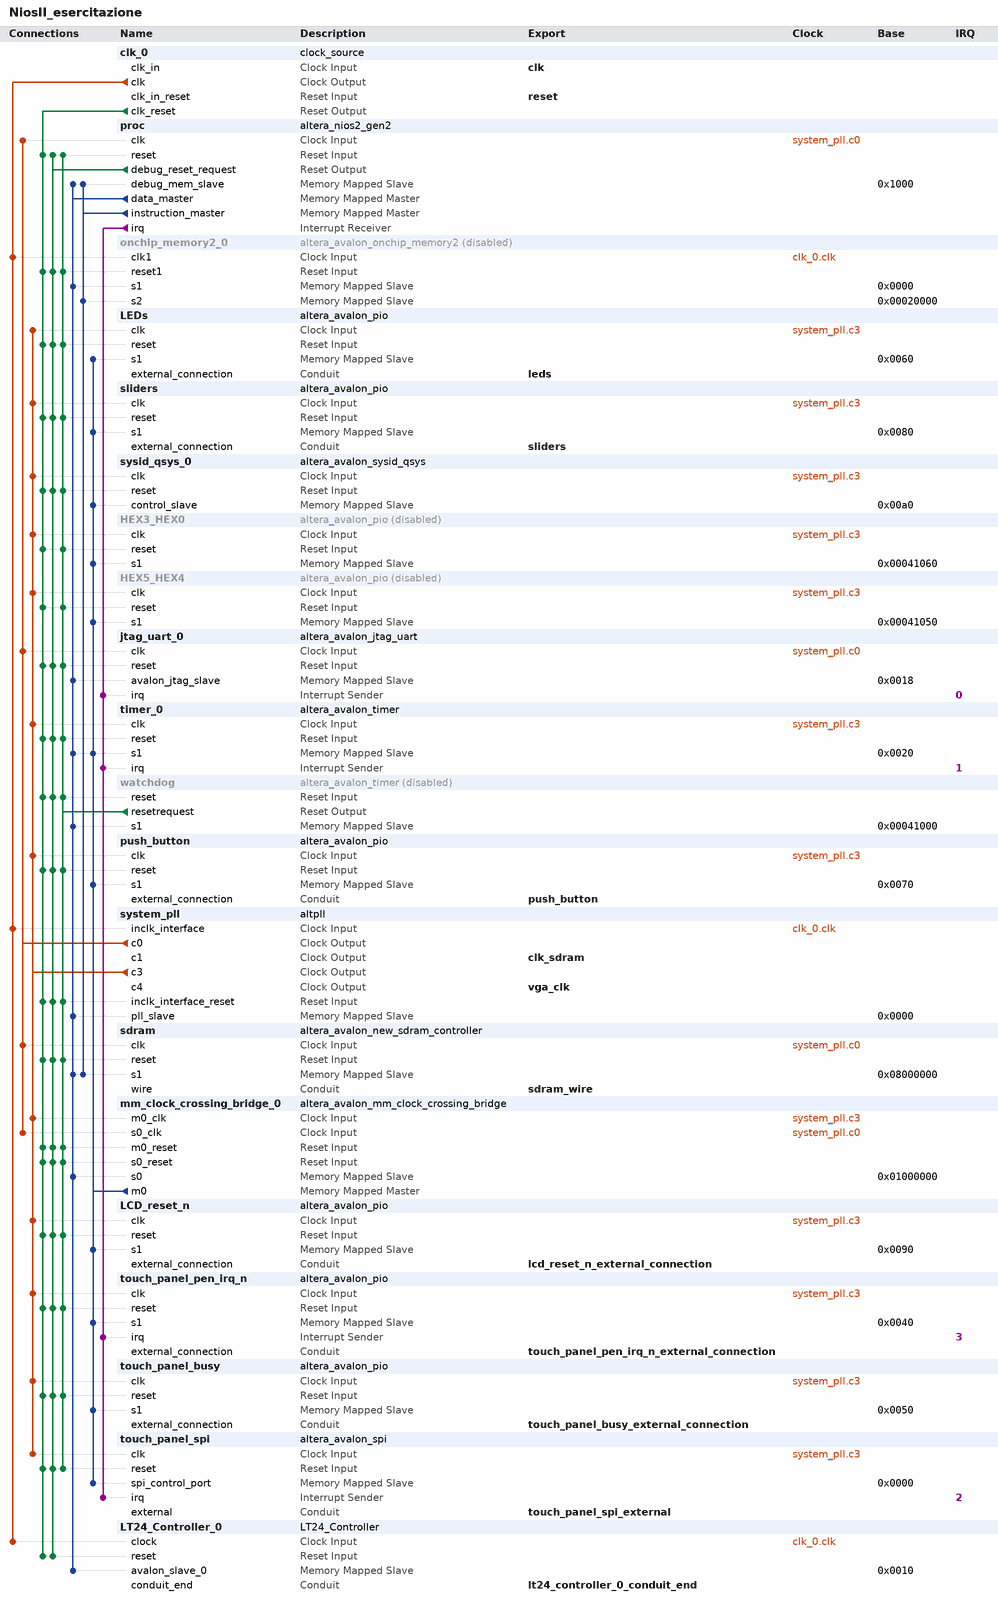
[diagram p0: system contents]
# Platform Designer (Qsys) system NiosII_esercitazione, MAX 10 10M50DAF484C7G
# Parameters at their usual value, and those the tool derives, are not listed.
package require -exact qsys 16.1
create_system NiosII_esercitazione
set_project_property DEVICE_FAMILY {MAX 10}
set_project_property DEVICE 10M50DAF484C7G

add_instance clk_0 clock_source 16.1
set_instance_parameter_value clk_0 clockFrequency 50000000
set_instance_parameter_value clk_0 resetSynchronousEdges DEASSERT

add_instance proc altera_nios2_gen2 16.1
set_instance_parameter_value proc dcache_size 2048
set_instance_parameter_value proc exceptionOffset 4194304
set_instance_parameter_value proc exceptionSlave sdram.s1
set_instance_parameter_value proc icache_size 4096
set_instance_parameter_value proc impl Fast
set_instance_parameter_value proc resetSlave sdram.s1

add_instance onchip_memory2_0 altera_avalon_onchip_memory2 16.1
set_instance_property onchip_memory2_0 ENABLED false
set_instance_parameter_value onchip_memory2_0 dataWidth 32
set_instance_parameter_value onchip_memory2_0 dualPort true
set_instance_parameter_value onchip_memory2_0 initMemContent true
set_instance_parameter_value onchip_memory2_0 initializationFileName onchip_mem.hex
set_instance_parameter_value onchip_memory2_0 memorySize 131072
set_instance_parameter_value onchip_memory2_0 singleClockOperation true

add_instance LEDs altera_avalon_pio 16.1
set_instance_parameter_value LEDs direction Output
set_instance_parameter_value LEDs width 10

add_instance sliders altera_avalon_pio 16.1
set_instance_parameter_value sliders direction Input
set_instance_parameter_value sliders width 10

add_instance sysid_qsys_0 altera_avalon_sysid_qsys 16.1
set_instance_parameter_value sysid_qsys_0 id 1

add_instance HEX3_HEX0 altera_avalon_pio 16.1
set_instance_property HEX3_HEX0 ENABLED false
set_instance_parameter_value HEX3_HEX0 direction Output
set_instance_parameter_value HEX3_HEX0 width 8

add_instance HEX5_HEX4 altera_avalon_pio 16.1
set_instance_property HEX5_HEX4 ENABLED false
set_instance_parameter_value HEX5_HEX4 direction Output
set_instance_parameter_value HEX5_HEX4 width 32

add_instance jtag_uart_0 altera_avalon_jtag_uart 16.1
set_instance_parameter_value jtag_uart_0 simInteractiveOptions NO_INTERACTIVE_WINDOWS

add_instance timer_0 altera_avalon_timer 16.1
set_instance_parameter_value timer_0 period 1
set_instance_parameter_value timer_0 periodUnits MSEC

add_instance watchdog altera_avalon_timer 16.1
set_instance_property watchdog ENABLED false
set_instance_parameter_value watchdog alwaysRun true
set_instance_parameter_value watchdog fixedPeriod true
set_instance_parameter_value watchdog period 5
set_instance_parameter_value watchdog periodUnits SEC
set_instance_parameter_value watchdog resetOutput true
set_instance_parameter_value watchdog snapshot false

add_instance push_button altera_avalon_pio 16.1
set_instance_parameter_value push_button direction Input
set_instance_parameter_value push_button width 2

add_instance system_pll altpll 16.1
set_instance_parameter_value system_pll CLK0_DIVIDE_BY 1
set_instance_parameter_value system_pll CLK0_MULTIPLY_BY 2
set_instance_parameter_value system_pll CLK1_DIVIDE_BY 1
set_instance_parameter_value system_pll CLK1_DUTY_CYCLE 50
set_instance_parameter_value system_pll CLK1_MULTIPLY_BY 2
set_instance_parameter_value system_pll CLK1_PHASE_SHIFT -3000
set_instance_parameter_value system_pll CLK2_DIVIDE_BY 5
set_instance_parameter_value system_pll CLK2_DUTY_CYCLE 50
set_instance_parameter_value system_pll CLK2_MULTIPLY_BY 1
set_instance_parameter_value system_pll CLK2_PHASE_SHIFT 0
set_instance_parameter_value system_pll CLK3_DIVIDE_BY 5
set_instance_parameter_value system_pll CLK3_DUTY_CYCLE 50
set_instance_parameter_value system_pll CLK3_MULTIPLY_BY 1
set_instance_parameter_value system_pll CLK3_PHASE_SHIFT 0
set_instance_parameter_value system_pll CLK4_DIVIDE_BY 5
set_instance_parameter_value system_pll CLK4_DUTY_CYCLE 50
set_instance_parameter_value system_pll CLK4_MULTIPLY_BY 4
set_instance_parameter_value system_pll CLK4_PHASE_SHIFT 0
set_instance_parameter_value system_pll INCLK0_INPUT_FREQUENCY 20000
set_instance_parameter_value system_pll PORT_ARESET PORT_UNUSED
set_instance_parameter_value system_pll PORT_LOCKED PORT_UNUSED
set_instance_parameter_value system_pll PORT_clk1 PORT_USED
set_instance_parameter_value system_pll PORT_clk2 PORT_USED
set_instance_parameter_value system_pll PORT_clk3 PORT_USED
set_instance_parameter_value system_pll PORT_clk4 PORT_USED

add_instance sdram altera_avalon_new_sdram_controller 16.1
set_instance_parameter_value sdram TAC 5.4
set_instance_parameter_value sdram TRCD 15.0
set_instance_parameter_value sdram TRP 15.0
set_instance_parameter_value sdram casLatency 3
set_instance_parameter_value sdram columnWidth 10
set_instance_parameter_value sdram dataWidth 16
set_instance_parameter_value sdram generateSimulationModel false
set_instance_parameter_value sdram model single_Micron_MT48LC4M32B2_7_chip
set_instance_parameter_value sdram numberOfBanks 4
set_instance_parameter_value sdram numberOfChipSelects 1
set_instance_parameter_value sdram powerUpDelay 100.0
set_instance_parameter_value sdram refreshPeriod 7.8125
set_instance_parameter_value sdram rowWidth 13

add_instance mm_clock_crossing_bridge_0 altera_avalon_mm_clock_crossing_bridge 16.1
set_instance_parameter_value mm_clock_crossing_bridge_0 ADDRESS_WIDTH 10
set_instance_parameter_value mm_clock_crossing_bridge_0 COMMAND_FIFO_DEPTH 8
set_instance_parameter_value mm_clock_crossing_bridge_0 DATA_WIDTH 32
set_instance_parameter_value mm_clock_crossing_bridge_0 MASTER_SYNC_DEPTH 2
set_instance_parameter_value mm_clock_crossing_bridge_0 MAX_BURST_SIZE 1
set_instance_parameter_value mm_clock_crossing_bridge_0 RESPONSE_FIFO_DEPTH 8
set_instance_parameter_value mm_clock_crossing_bridge_0 SLAVE_SYNC_DEPTH 2
set_instance_parameter_value mm_clock_crossing_bridge_0 USE_AUTO_ADDRESS_WIDTH 0

add_instance LCD_reset_n altera_avalon_pio 16.1
set_instance_parameter_value LCD_reset_n direction Output
set_instance_parameter_value LCD_reset_n width 1

add_instance touch_panel_pen_irq_n altera_avalon_pio 16.1
set_instance_parameter_value touch_panel_pen_irq_n captureEdge true
set_instance_parameter_value touch_panel_pen_irq_n direction Input
set_instance_parameter_value touch_panel_pen_irq_n edgeType FALLING
set_instance_parameter_value touch_panel_pen_irq_n generateIRQ true
set_instance_parameter_value touch_panel_pen_irq_n irqType EDGE
set_instance_parameter_value touch_panel_pen_irq_n width 1

add_instance touch_panel_busy altera_avalon_pio 16.1
set_instance_parameter_value touch_panel_busy direction Input
set_instance_parameter_value touch_panel_busy width 1

add_instance touch_panel_spi altera_avalon_spi 16.1
set_instance_parameter_value touch_panel_spi clockPolarity 0
set_instance_parameter_value touch_panel_spi dataWidth 8
set_instance_parameter_value touch_panel_spi masterSPI true
set_instance_parameter_value touch_panel_spi numberOfSlaves 1
set_instance_parameter_value touch_panel_spi targetClockRate 32000

add_instance LT24_Controller_0 LT24_Controller 1.0

# connections
add_connection clk_0.clk LT24_Controller_0.clock clock
add_connection clk_0.clk onchip_memory2_0.clk1 clock
add_connection clk_0.clk system_pll.inclk_interface clock
add_connection system_pll.c0 jtag_uart_0.clk clock
add_connection system_pll.c0 mm_clock_crossing_bridge_0.s0_clk clock
add_connection system_pll.c0 proc.clk clock
add_connection system_pll.c0 sdram.clk clock
add_connection system_pll.c3 HEX3_HEX0.clk clock
add_connection system_pll.c3 HEX5_HEX4.clk clock
add_connection system_pll.c3 LCD_reset_n.clk clock
add_connection system_pll.c3 LEDs.clk clock
add_connection system_pll.c3 mm_clock_crossing_bridge_0.m0_clk clock
add_connection system_pll.c3 push_button.clk clock
add_connection system_pll.c3 sliders.clk clock
add_connection system_pll.c3 sysid_qsys_0.clk clock
add_connection system_pll.c3 timer_0.clk clock
add_connection system_pll.c3 touch_panel_busy.clk clock
add_connection system_pll.c3 touch_panel_pen_irq_n.clk clock
add_connection system_pll.c3 touch_panel_spi.clk clock
add_connection clk_0.clk_reset HEX3_HEX0.reset reset
add_connection clk_0.clk_reset HEX5_HEX4.reset reset
add_connection clk_0.clk_reset jtag_uart_0.reset reset
add_connection clk_0.clk_reset LCD_reset_n.reset reset
add_connection clk_0.clk_reset LEDs.reset reset
add_connection clk_0.clk_reset LT24_Controller_0.reset reset
add_connection clk_0.clk_reset mm_clock_crossing_bridge_0.m0_reset reset
add_connection clk_0.clk_reset mm_clock_crossing_bridge_0.s0_reset reset
add_connection clk_0.clk_reset onchip_memory2_0.reset1 reset
add_connection clk_0.clk_reset proc.reset reset
add_connection clk_0.clk_reset push_button.reset reset
add_connection clk_0.clk_reset sdram.reset reset
add_connection clk_0.clk_reset sliders.reset reset
add_connection clk_0.clk_reset sysid_qsys_0.reset reset
add_connection clk_0.clk_reset system_pll.inclk_interface_reset reset
add_connection clk_0.clk_reset timer_0.reset reset
add_connection clk_0.clk_reset touch_panel_busy.reset reset
add_connection clk_0.clk_reset touch_panel_pen_irq_n.reset reset
add_connection clk_0.clk_reset touch_panel_spi.reset reset
add_connection clk_0.clk_reset watchdog.reset reset
add_connection proc.debug_reset_request jtag_uart_0.reset reset
add_connection proc.debug_reset_request LCD_reset_n.reset reset
add_connection proc.debug_reset_request LEDs.reset reset
add_connection proc.debug_reset_request LT24_Controller_0.reset reset
add_connection proc.debug_reset_request mm_clock_crossing_bridge_0.m0_reset reset
add_connection proc.debug_reset_request mm_clock_crossing_bridge_0.s0_reset reset
add_connection proc.debug_reset_request onchip_memory2_0.reset1 reset
add_connection proc.debug_reset_request proc.reset reset
add_connection proc.debug_reset_request push_button.reset reset
add_connection proc.debug_reset_request sdram.reset reset
add_connection proc.debug_reset_request sliders.reset reset
add_connection proc.debug_reset_request sysid_qsys_0.reset reset
add_connection proc.debug_reset_request system_pll.inclk_interface_reset reset
add_connection proc.debug_reset_request timer_0.reset reset
add_connection proc.debug_reset_request touch_panel_busy.reset reset
add_connection proc.debug_reset_request touch_panel_pen_irq_n.reset reset
add_connection proc.debug_reset_request touch_panel_spi.reset reset
add_connection proc.debug_reset_request watchdog.reset reset
add_connection watchdog.resetrequest HEX3_HEX0.reset reset
add_connection watchdog.resetrequest HEX5_HEX4.reset reset
add_connection watchdog.resetrequest jtag_uart_0.reset reset
add_connection watchdog.resetrequest LCD_reset_n.reset reset
add_connection watchdog.resetrequest LEDs.reset reset
add_connection watchdog.resetrequest mm_clock_crossing_bridge_0.m0_reset reset
add_connection watchdog.resetrequest mm_clock_crossing_bridge_0.s0_reset reset
add_connection watchdog.resetrequest onchip_memory2_0.reset1 reset
add_connection watchdog.resetrequest proc.reset reset
add_connection watchdog.resetrequest push_button.reset reset
add_connection watchdog.resetrequest sdram.reset reset
add_connection watchdog.resetrequest sliders.reset reset
add_connection watchdog.resetrequest sysid_qsys_0.reset reset
add_connection watchdog.resetrequest system_pll.inclk_interface_reset reset
add_connection watchdog.resetrequest timer_0.reset reset
add_connection watchdog.resetrequest touch_panel_busy.reset reset
add_connection watchdog.resetrequest touch_panel_pen_irq_n.reset reset
add_connection watchdog.resetrequest touch_panel_spi.reset reset
add_connection watchdog.resetrequest watchdog.reset reset
add_connection mm_clock_crossing_bridge_0.m0 HEX3_HEX0.s1 avalon
set_connection_parameter_value mm_clock_crossing_bridge_0.m0/HEX3_HEX0.s1 baseAddress 0x00041060
add_connection mm_clock_crossing_bridge_0.m0 HEX5_HEX4.s1 avalon
set_connection_parameter_value mm_clock_crossing_bridge_0.m0/HEX5_HEX4.s1 baseAddress 0x00041050
add_connection mm_clock_crossing_bridge_0.m0 LCD_reset_n.s1 avalon
set_connection_parameter_value mm_clock_crossing_bridge_0.m0/LCD_reset_n.s1 baseAddress 0x0090
add_connection mm_clock_crossing_bridge_0.m0 LEDs.s1 avalon
set_connection_parameter_value mm_clock_crossing_bridge_0.m0/LEDs.s1 baseAddress 0x0060
add_connection mm_clock_crossing_bridge_0.m0 push_button.s1 avalon
set_connection_parameter_value mm_clock_crossing_bridge_0.m0/push_button.s1 baseAddress 0x0070
add_connection mm_clock_crossing_bridge_0.m0 sliders.s1 avalon
set_connection_parameter_value mm_clock_crossing_bridge_0.m0/sliders.s1 baseAddress 0x0080
add_connection mm_clock_crossing_bridge_0.m0 sysid_qsys_0.control_slave avalon
set_connection_parameter_value mm_clock_crossing_bridge_0.m0/sysid_qsys_0.control_slave baseAddress 0x00a0
add_connection mm_clock_crossing_bridge_0.m0 timer_0.s1 avalon
set_connection_parameter_value mm_clock_crossing_bridge_0.m0/timer_0.s1 baseAddress 0x0020
add_connection mm_clock_crossing_bridge_0.m0 touch_panel_busy.s1 avalon
set_connection_parameter_value mm_clock_crossing_bridge_0.m0/touch_panel_busy.s1 baseAddress 0x0050
add_connection mm_clock_crossing_bridge_0.m0 touch_panel_pen_irq_n.s1 avalon
set_connection_parameter_value mm_clock_crossing_bridge_0.m0/touch_panel_pen_irq_n.s1 baseAddress 0x0040
add_connection mm_clock_crossing_bridge_0.m0 touch_panel_spi.spi_control_port avalon
set_connection_parameter_value mm_clock_crossing_bridge_0.m0/touch_panel_spi.spi_control_port baseAddress 0x0000
add_connection proc.data_master jtag_uart_0.avalon_jtag_slave avalon
set_connection_parameter_value proc.data_master/jtag_uart_0.avalon_jtag_slave baseAddress 0x0018
add_connection proc.data_master LT24_Controller_0.avalon_slave_0 avalon
set_connection_parameter_value proc.data_master/LT24_Controller_0.avalon_slave_0 baseAddress 0x0010
add_connection proc.data_master mm_clock_crossing_bridge_0.s0 avalon
set_connection_parameter_value proc.data_master/mm_clock_crossing_bridge_0.s0 baseAddress 0x01000000
add_connection proc.data_master onchip_memory2_0.s1 avalon
set_connection_parameter_value proc.data_master/onchip_memory2_0.s1 baseAddress 0x0000
add_connection proc.data_master proc.debug_mem_slave avalon
set_connection_parameter_value proc.data_master/proc.debug_mem_slave baseAddress 0x1000
add_connection proc.data_master sdram.s1 avalon
set_connection_parameter_value proc.data_master/sdram.s1 baseAddress 0x08000000
add_connection proc.data_master system_pll.pll_slave avalon
set_connection_parameter_value proc.data_master/system_pll.pll_slave baseAddress 0x0000
add_connection proc.data_master timer_0.s1 avalon
set_connection_parameter_value proc.data_master/timer_0.s1 baseAddress 0x0020
add_connection proc.data_master watchdog.s1 avalon
set_connection_parameter_value proc.data_master/watchdog.s1 baseAddress 0x00041000
add_connection proc.instruction_master onchip_memory2_0.s2 avalon
set_connection_parameter_value proc.instruction_master/onchip_memory2_0.s2 baseAddress 0x00020000
add_connection proc.instruction_master proc.debug_mem_slave avalon
set_connection_parameter_value proc.instruction_master/proc.debug_mem_slave baseAddress 0x1000
add_connection proc.instruction_master sdram.s1 avalon
set_connection_parameter_value proc.instruction_master/sdram.s1 baseAddress 0x08000000
add_connection proc.irq jtag_uart_0.irq interrupt
set_connection_parameter_value proc.irq/jtag_uart_0.irq irqNumber 0
add_connection proc.irq timer_0.irq interrupt
set_connection_parameter_value proc.irq/timer_0.irq irqNumber 1
add_connection proc.irq touch_panel_pen_irq_n.irq interrupt
set_connection_parameter_value proc.irq/touch_panel_pen_irq_n.irq irqNumber 3
add_connection proc.irq touch_panel_spi.irq interrupt
set_connection_parameter_value proc.irq/touch_panel_spi.irq irqNumber 2

# exported interfaces
add_interface clk clock sink
set_interface_property clk EXPORT_OF clk_0.clk_in
add_interface clk_sdram clock source
set_interface_property clk_sdram EXPORT_OF system_pll.c1
add_interface lcd_reset_n_external_connection conduit end
set_interface_property lcd_reset_n_external_connection EXPORT_OF LCD_reset_n.external_connection
add_interface leds conduit end
set_interface_property leds EXPORT_OF LEDs.external_connection
add_interface lt24_controller_0_conduit_end conduit end
set_interface_property lt24_controller_0_conduit_end EXPORT_OF LT24_Controller_0.conduit_end
add_interface push_button conduit end
set_interface_property push_button EXPORT_OF push_button.external_connection
add_interface reset reset sink
set_interface_property reset EXPORT_OF clk_0.clk_in_reset
add_interface sdram_wire conduit end
set_interface_property sdram_wire EXPORT_OF sdram.wire
add_interface sliders conduit end
set_interface_property sliders EXPORT_OF sliders.external_connection
add_interface touch_panel_busy_external_connection conduit end
set_interface_property touch_panel_busy_external_connection EXPORT_OF touch_panel_busy.external_connection
add_interface touch_panel_pen_irq_n_external_connection conduit end
set_interface_property touch_panel_pen_irq_n_external_connection EXPORT_OF touch_panel_pen_irq_n.external_connection
add_interface touch_panel_spi_external conduit end
set_interface_property touch_panel_spi_external EXPORT_OF touch_panel_spi.external
add_interface vga_clk clock source
set_interface_property vga_clk EXPORT_OF system_pll.c4

set_interconnect_requirement {$system} qsys_mm.clockCrossingAdapter HANDSHAKE
set_interconnect_requirement {$system} qsys_mm.enableEccProtection FALSE
set_interconnect_requirement {$system} qsys_mm.insertDefaultSlave FALSE
set_interconnect_requirement {$system} qsys_mm.maxAdditionalLatency 1

save_system NiosII_esercitazione.qsys
